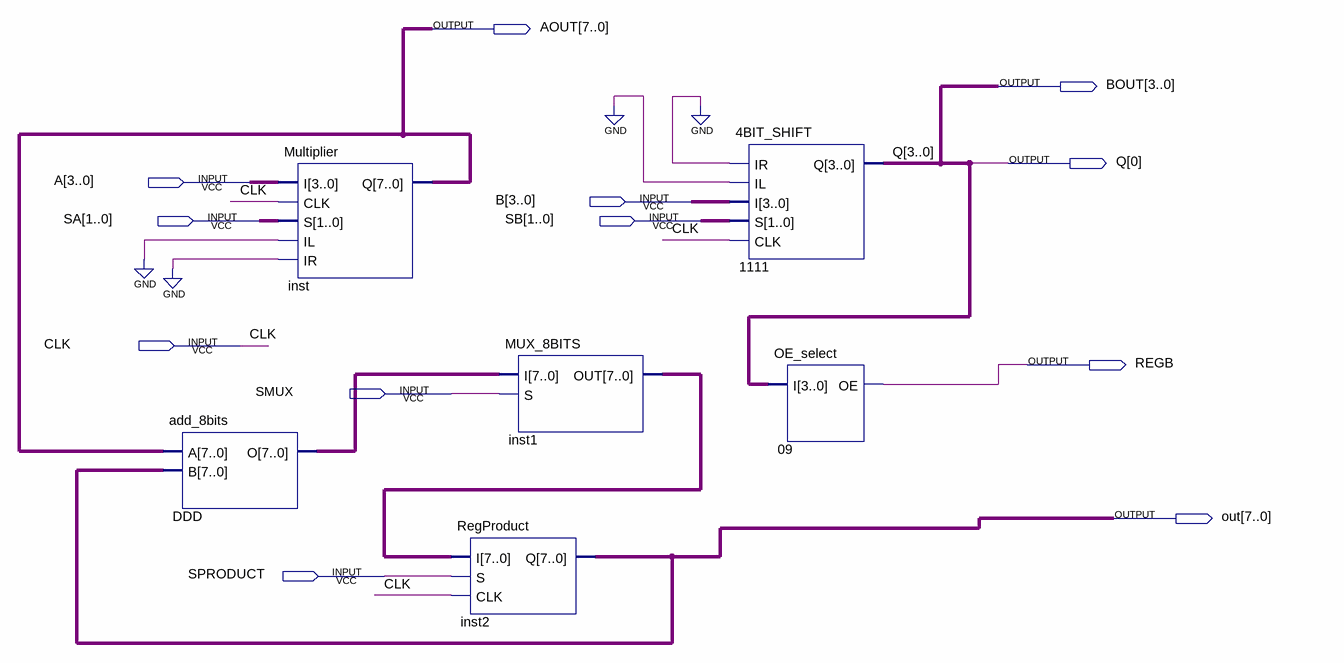
[diagram p0: schematic sheet]
// Quartus schematic datapath.bdf as structural Verilog: 6 symbols, 12 pins
module datapath (
  input  [3:0] A,
  input  [3:0] B,
  input  [1:0] SA,
  input  [1:0] SB,
  input  CLK,
  input  SMUX,
  input  SPRODUCT,
  output [7:0] AOUT,
  output [3:0] BOUT,
  output [0:0] Q,
  output REGB,
  output [7:0] out
);

  wire [7:0] DDD_o, inst1_out;

  add_8bits DDD (.A(AOUT), .B(out), .O(DDD_o));
  Multiplier inst (.I(A), .CLK(CLK), .S(SA), .IL(1'b0), .IR(1'b0), .Q(AOUT));
  MUX_8BITS inst1 (.I(DDD_o), .S(SMUX), .OUT(inst1_out));
  RegProduct inst2 (.I(inst1_out), .S(SPRODUCT), .CLK(CLK), .Q(out));
  \4BIT_SHIFT  u_1111 (.IR(1'b0), .IL(1'b0), .I(B), .S(SB), .CLK(CLK), .Q(BOUT));
  OE_select u_09 (.I(BOUT), .OE(REGB));

  assign Q[0] = BOUT[0];

  // Other names for the same wires on the sheet: Q[3:1] = BOUT[3:1]
endmodule
